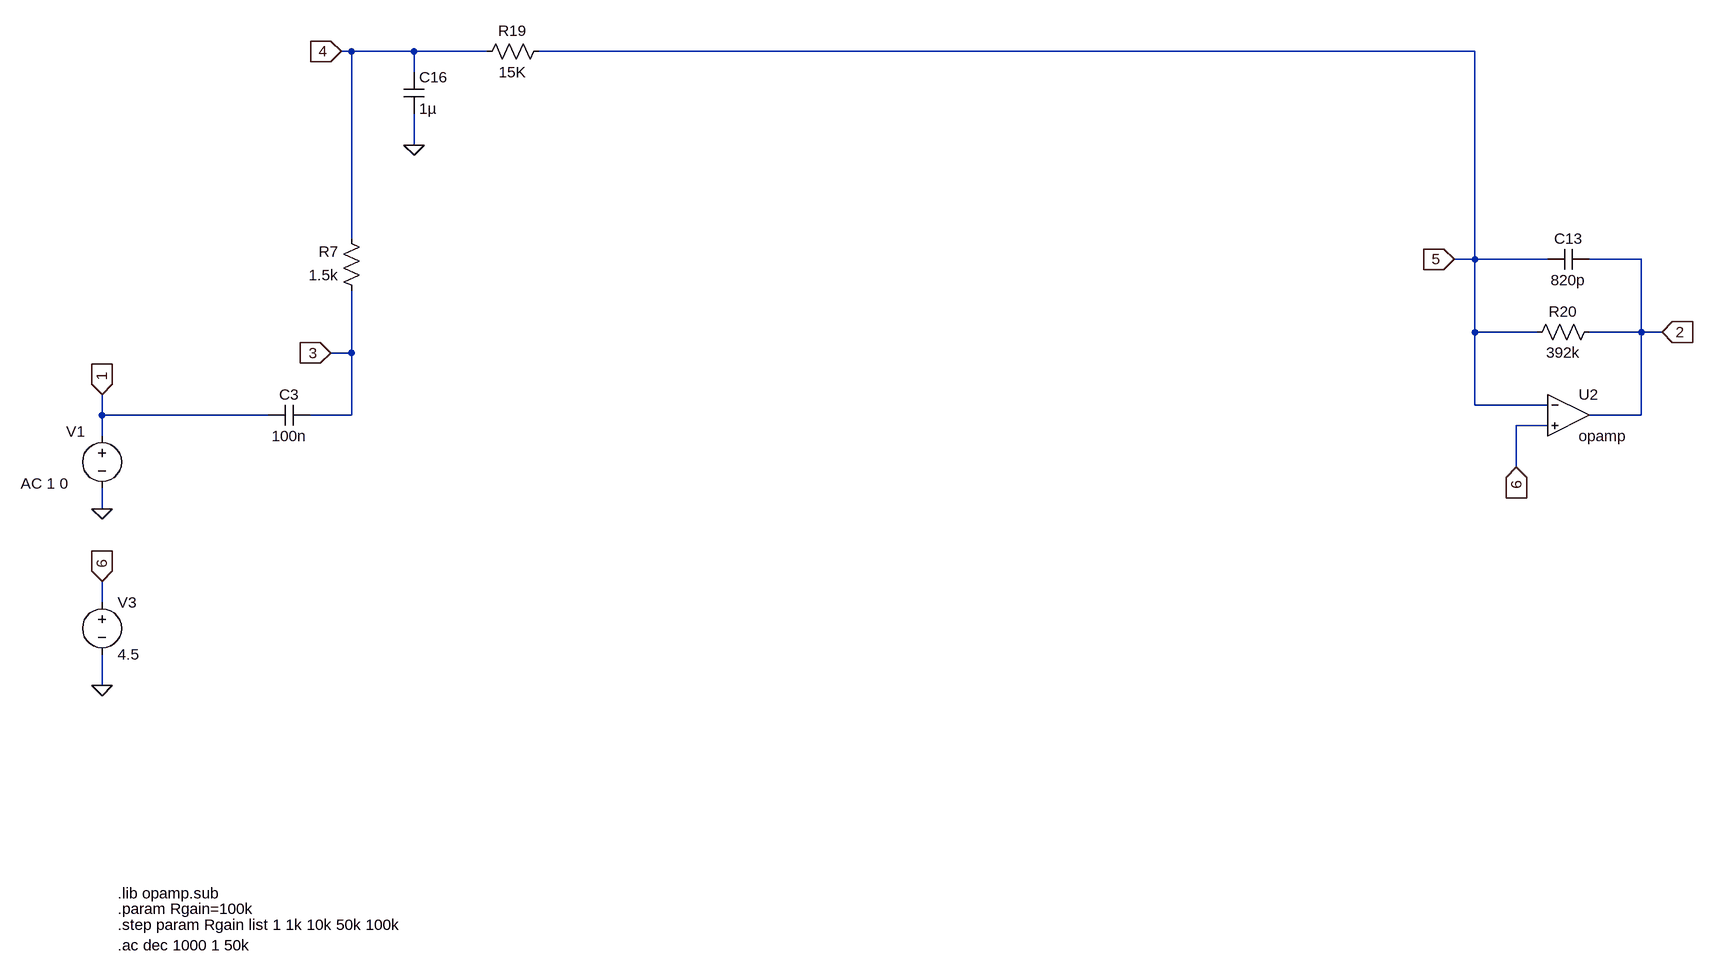
[diagram p0: schematic Klon-Centaur_sum_path_1-OLD.asc]
Klon-Centaur_sum_path_1-OLD.asc, the LTspice schematic file:
Version 4
SHEET 1 4496 5064
WIRE -32 2000 -48 2000
WIRE 64 2000 -32 2000
WIRE 176 2000 64 2000
WIRE 1696 2000 256 2000
WIRE 64 2032 64 2000
WIRE 64 2144 64 2096
WIRE -32 2288 -32 2000
WIRE 1696 2320 1696 2000
WIRE 1696 2320 1664 2320
WIRE 1808 2320 1696 2320
WIRE 1952 2320 1872 2320
WIRE 1696 2432 1696 2320
WIRE 1792 2432 1696 2432
WIRE 1952 2432 1952 2320
WIRE 1952 2432 1872 2432
WIRE 1984 2432 1952 2432
WIRE -32 2464 -32 2368
WIRE -32 2464 -64 2464
WIRE 1696 2544 1696 2432
WIRE 1808 2544 1696 2544
WIRE -416 2560 -416 2528
WIRE -160 2560 -416 2560
WIRE -32 2560 -32 2464
WIRE -32 2560 -96 2560
WIRE 1952 2560 1952 2432
WIRE 1952 2560 1872 2560
WIRE 1808 2576 1760 2576
WIRE -416 2592 -416 2560
WIRE 1760 2640 1760 2576
WIRE -416 2704 -416 2672
WIRE -416 2848 -416 2816
WIRE -416 2976 -416 2928
FLAG -416 2528 1
IOPIN -416 2528 In
FLAG 64 2144 0
FLAG 1760 2640 6
IOPIN 1760 2640 In
FLAG -416 2976 0
FLAG -416 2816 6
IOPIN -416 2816 In
FLAG -416 2704 0
FLAG -64 2464 3
IOPIN -64 2464 In
FLAG -48 2000 4
IOPIN -48 2000 In
FLAG 1664 2320 5
IOPIN 1664 2320 In
FLAG 1984 2432 2
IOPIN 1984 2432 In
SYMBOL voltage -416 2576 R0
WINDOW 0 -55 9 Left 2
WINDOW 123 -125 89 Left 2
WINDOW 39 0 0 Left 0
WINDOW 3 -289 58 Left 2
SYMATTR InstName V1
SYMATTR Value2 AC 1 0
SYMATTR Value ""
SYMBOL cap -96 2544 R90
WINDOW 0 0 32 VBottom 2
WINDOW 3 32 32 VTop 2
SYMATTR InstName C3
SYMATTR Value 100n
SYMBOL res -16 2384 R180
WINDOW 0 36 76 Left 2
WINDOW 3 36 40 Left 2
SYMATTR InstName R7
SYMATTR Value 1.5k
SYMBOL res 272 1984 R90
WINDOW 0 0 56 VBottom 2
WINDOW 3 32 56 VTop 2
SYMATTR InstName R19
SYMATTR Value 15K
SYMBOL res 1888 2416 R90
WINDOW 0 0 56 VBottom 2
WINDOW 3 32 56 VTop 2
SYMATTR InstName R20
SYMATTR Value 392k
SYMBOL cap 1872 2304 R90
WINDOW 0 0 32 VBottom 2
WINDOW 3 32 32 VTop 2
SYMATTR InstName C13
SYMATTR Value 820p
SYMBOL voltage -416 2832 R0
WINDOW 123 0 0 Left 0
WINDOW 39 0 0 Left 0
SYMATTR InstName V3
SYMATTR Value 4.5
SYMBOL cap 48 2032 R0
SYMATTR InstName C16
SYMATTR Value 1µ
SYMBOL OpAmps\\opamp 1840 2496 R0
SYMATTR InstName U2
TEXT -392 3320 Left 2 !.param Rgain=100k
TEXT -392 3296 Left 2 !.lib opamp.sub
TEXT -392 3344 Left 2 !.step param Rgain list 1 1k 10k 50k 100k
TEXT -392 3376 Left 2 !.ac dec 1000 1 50k

The netlist it stands for:
* Klon-Centaur_sum_path_1-OLD.asc
V1 1 0 AC 1 0
C3 3 1 100n
R7 3 4 1.5k
R19 5 4 15K
R20 2 5 392k
C13 2 5 820p
V3 6 0 4.5
C16 4 0 1µ
XU2 5 6 2 opamp Aol=100K GBW=10Meg  ; pins invin noninvin out
.param Rgain=100k
.lib opamp.sub
.step param Rgain list 1 1k 10k 50k 100k
.ac dec 1000 1 50k
.backanno
.end